# EAGLE design Big T Split - Motherboard Socket (EAGLE 9.6.1)
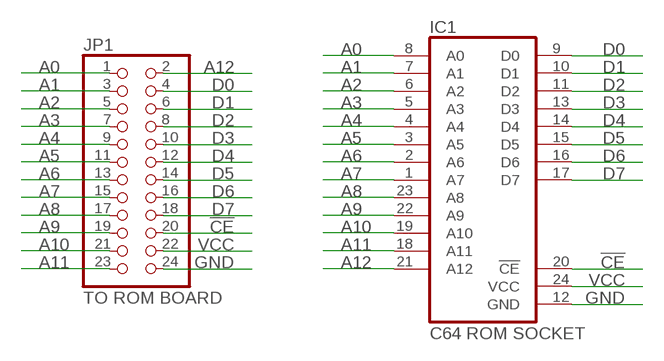
[diagram p0: schematic, sheet 1]

## Parts
IC1  C64 ROM SOCKET  2364  [DIL24]
JP1  TO ROM BOARD  PINHD-2X12  [2X12]

## Nets
!CE: IC1.20(!CE) JP1.20
A0: IC1.8(A0) JP1.1
A1: IC1.7(A1) JP1.3
A2: IC1.6(A2) JP1.5
A3: IC1.5(A3) JP1.7
A4: IC1.4(A4) JP1.9
A5: IC1.3(A5) JP1.11
A6: IC1.2(A6) JP1.13
A7: IC1.1(A7) JP1.15
A8: IC1.23(A8) JP1.17
A9: IC1.22(A9) JP1.19
A10: IC1.19(A10) JP1.21
A11: IC1.18(A11) JP1.23
A12: IC1.21(A12) JP1.2
D0: IC1.9(D0) JP1.4
D1: IC1.10(D1) JP1.6
D2: IC1.11(D2) JP1.8
D3: IC1.13(D3) JP1.10
D4: IC1.14(D4) JP1.12
D5: IC1.15(D5) JP1.14
D6: IC1.16(D6) JP1.16
D7: IC1.17(D7) JP1.18
GND: IC1.12(GND) JP1.24
VCC: IC1.24(VCC) JP1.22

## Library data of the parts
IC1 = myparts:2364: MEMORY
JP1 = pinhead:PINHD-2X12: PIN HEADER

## Board
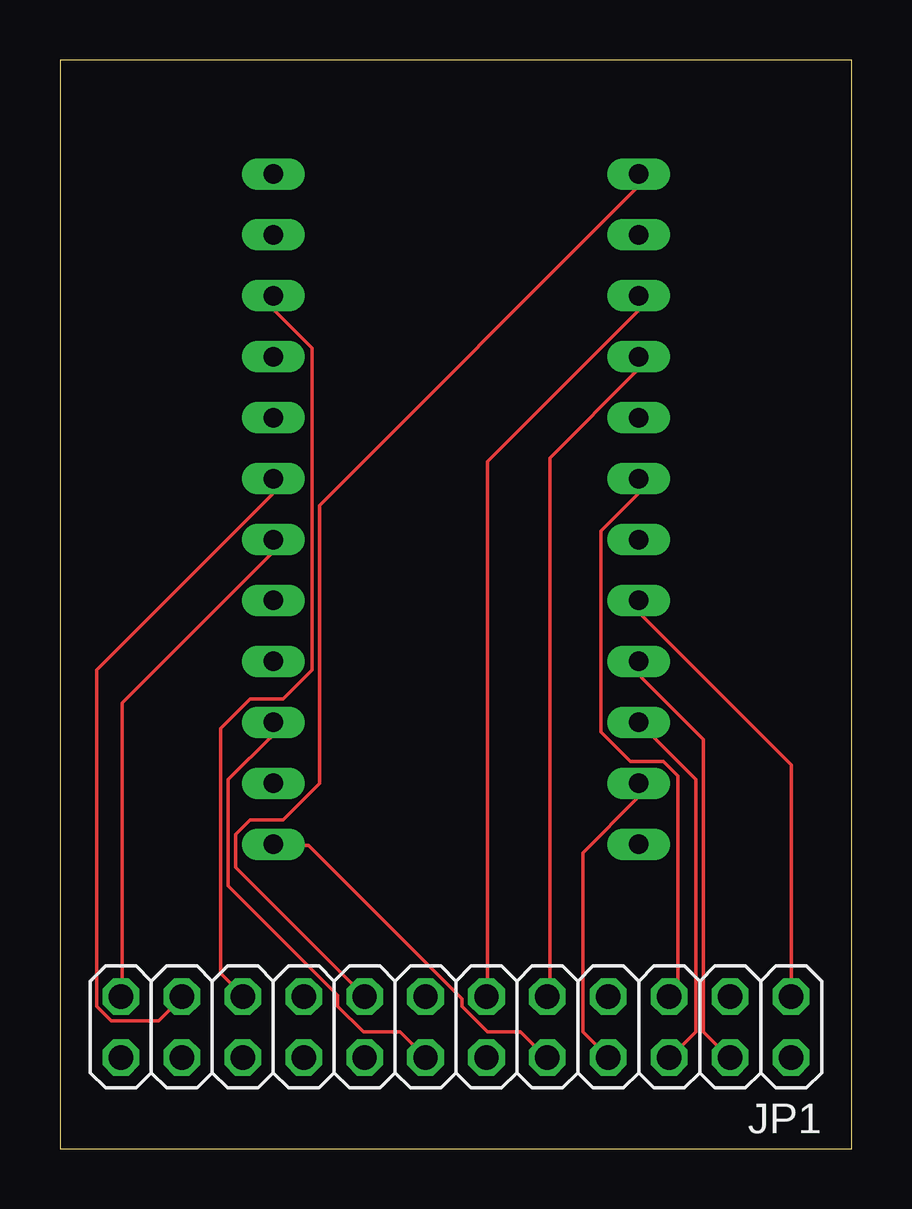
[diagram p1: board, top side]
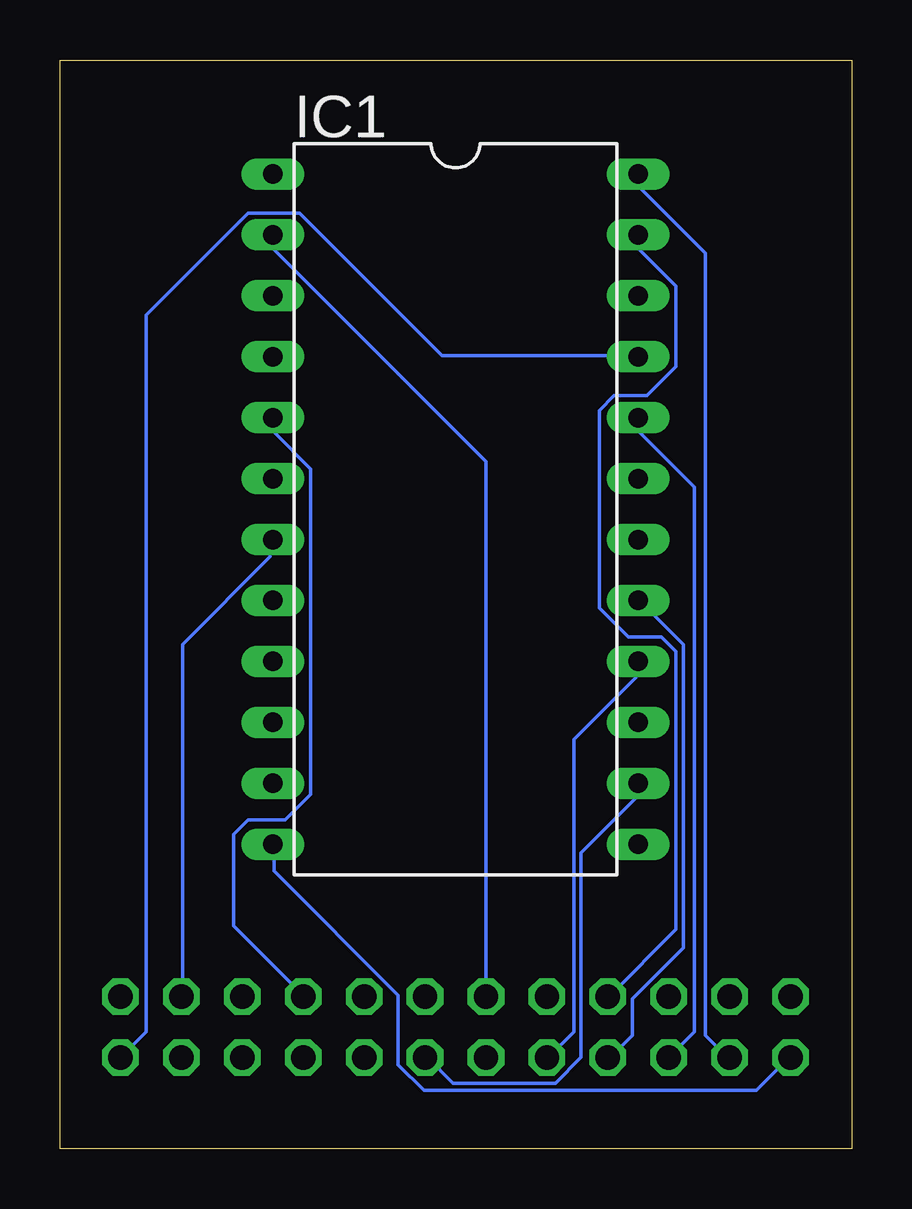
[diagram p2: board, bottom side, seen from below]

Size 33 x 45.39 mm. Coordinates in mm from the lower left corner, seen from the top.
Outline: 0,0 33,0 33,45.39 0,45.39 0,0
Copper layers (1*16): Top 0.035mm / dielectric 1.5mm / Bottom 0.035mm
Design rules "default": minimum track width 6mil, minimum drill 0.35mm, track to track 6mil, track to pad 6mil, pad to pad 6mil, via to via 6mil, smd to smd 6mil, copper to edge 40mil, drill to drill 6mil, minimum pad ring 10mil, minimum via ring 8mil, stop-mask expansion 4mil, vias tented up to drill 0mil, thermal gap 10mil

### Footprints (pad centres in the part's own frame; a part is rotated, then mirrored left to right if it is on the bottom)
DIL24 = drill 0.813 long: 1 -13.97,-7.62; 2 -11.43,-7.62; 3 -8.89,-7.62; 4 -6.35,-7.62; 5 -3.81,-7.62; 6 -1.27,-7.62; 7 1.27,-7.62; 8 3.81,-7.62; 9 6.35,-7.62; 10 8.89,-7.62; 11 11.43,-7.62; 12 13.97,-7.62; 13 13.97,7.62; 14 11.43,7.62; 15 8.89,7.62; 16 6.35,7.62; 17 3.81,7.62; 18 1.27,7.62; 19 -1.27,7.62; 20 -3.81,7.62; 21 -6.35,7.62; 22 -8.89,7.62; 23 -11.43,7.62; 24 -13.97,7.62
2X12 = drill 1.016 octagon: 1 -13.97,-1.27; 2 -13.97,1.27; 3 -11.43,-1.27; 4 -11.43,1.27; 5 -8.89,-1.27; 6 -8.89,1.27; 7 -6.35,-1.27; 8 -6.35,1.27; 9 -3.81,-1.27; 10 -3.81,1.27; 11 -1.27,-1.27; 12 -1.27,1.27; 13 1.27,-1.27; 14 1.27,1.27; 15 3.81,-1.27; 16 3.81,1.27; 17 6.35,-1.27; 18 6.35,1.27; 19 8.89,-1.27; 20 8.89,1.27; 21 11.43,-1.27; 22 11.43,1.27; 23 13.97,-1.27; 24 13.97,1.27

### Placement (x,y rotation side)
IC1  16.51,26.67 270 bottom
JP1  16.51,5.08 180 top

### Tracks (layer width: path | path; a pad name or v marks a point on that pad's centre or on a via)
!CE
  Bottom 0.152: JP1.20 6.55,4.88 6.55,27.58 8.84,29.87 8.84,30.48 IC1.20
A0
  Top 0.152: JP1.1 30.48,16 24.23,22.25 24.23,22.86 IC1.8
A1
  Bottom 0.152: IC1.7 24.23,25.3 24.23,24.69 27.89,21.03 27.89,6.4 JP1.3
A2
  Top 0.152: JP1.5 25.76,6.71 25.76,15.54 25.15,16.15 23.77,16.15 22.55,17.37 22.55,25.76 24.08,27.28 24.08,27.89 IC1.6
A3
  Bottom 0.152: IC1.5 24.08,30.48 24.08,29.87 22.55,28.35 22.55,14.78 23.62,13.72 25.15,13.72 25.76,13.11 25.76,9.3 22.86,6.4 JP1.7
A4
  Top 0.152: IC1.4 24.08,32.92 24.08,32.46 20.42,28.8 20.42,6.4 JP1.9
A5
  Top 0.152: IC1.3 24.08,35.51 24.08,34.9 17.83,28.65 17.83,6.4 JP1.11
A6
  Bottom 0.152: JP1.13 15.24,28.65 24.08,37.49 24.08,38.1 IC1.2
A7
  Top 0.152: JP1.15 7.32,11.73 7.32,13.11 7.92,13.72 9.3,13.72 10.82,15.24 10.82,26.82 24.08,40.08 24.08,40.54 IC1.1
A8
  Bottom 0.152: IC1.23 8.84,38.1 8.84,37.49 7.32,35.97 7.32,32.61 8.53,31.39 9.91,31.39 10.52,30.79 10.52,22.55 9.3,21.34 7.92,21.34 7.32,20.73 7.32,9.14 10.06,6.4 JP1.17
A9
  Top 0.152: IC1.22 8.99,35.51 8.99,34.9 10.52,33.38 10.52,19.96 9.3,18.75 7.92,18.75 6.71,17.53 6.71,7.32 7.62,6.4 JP1.19
A10
  Top 0.152: IC1.19 8.84,27.89 8.84,27.28 1.52,19.96 1.52,5.94 2.13,5.33 4.12,5.33 5.03,6.25 JP1.21
A11
  Top 0.152: IC1.18 8.84,25.3 8.84,24.84 2.59,18.59 2.59,6.4 JP1.23
A12
  Bottom 0.152: JP1.2 29.41,4.88 29.41,34.75 25.15,39.01 23.01,39.01 17.07,33.07 8.99,33.07 IC1.21
D0
  Top 0.152: IC1.9 24.23,20.27 24.23,19.66 26.82,17.07 26.82,4.88 27.89,3.81 JP1.4
D1
  Top 0.152: IC1.10 26.52,15.39 26.52,4.88 25.45,3.81 JP1.6
D2
  Top 0.152: JP1.8 21.79,4.88 21.79,12.34 24.08,14.63 24.08,15.24 IC1.11
D3
  Top 0.152: IC1.13 8.99,12.65 10.36,12.65 16.76,6.25 16.76,5.94 17.83,4.88 19.2,4.88 20.27,3.81 JP1.10
D4
  Bottom 0.152: IC1.14 8.99,15.24 8.99,14.63 11.28,12.34 11.28,3.81 12.34,2.74 16.61,2.74 17.68,3.81 JP1.12
D5
  Top 0.152: JP1.14 14.17,4.88 12.65,4.88 11.58,5.94 11.58,6.4 7.01,10.97 7.01,15.39 8.84,17.22 8.84,17.68 IC1.15
D6
  Bottom 0.152: IC1.16 8.99,20.27 8.99,19.66 11.58,17.07 11.58,4.88 12.65,3.81 JP1.16
D7
  Bottom 0.152: IC1.17 8.84,22.86 7.01,21.03 7.01,8.38 9.14,6.25 9.14,4.72 10.06,3.81 JP1.18
GND
  Bottom 0.152: IC1.12 24.08,12.65 24.08,11.58 18.9,6.4 18.9,3.5 17.83,2.44 3.96,2.44 2.59,3.81 JP1.24
VCC
  Bottom 0.152: IC1.24 8.84,40.54 8.84,40.08 6.1,37.34 6.1,4.72 5.18,3.81 JP1.22